# EAGLE design 327final (EAGLE 9.6.2)
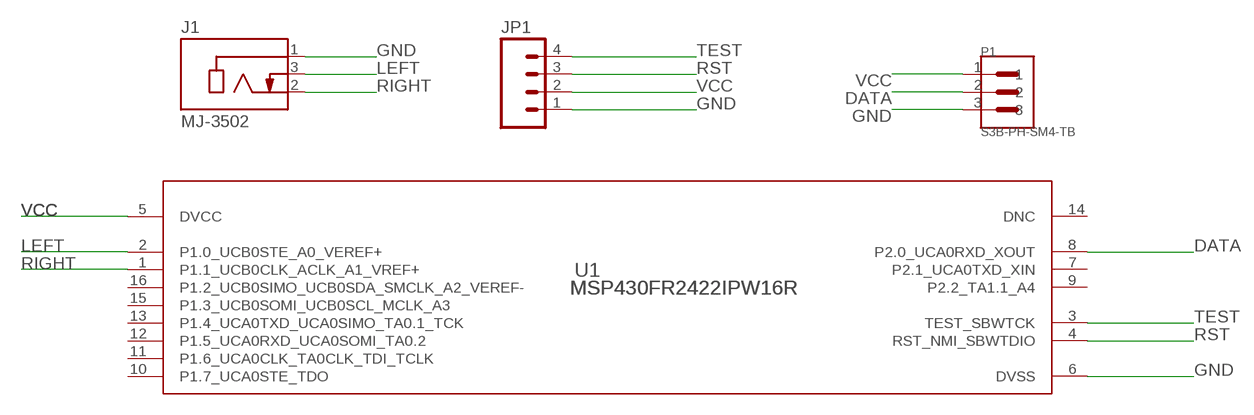
[diagram p0: schematic, sheet 1]

## Parts
J1  MJ-3502  [CUI_MJ-3502]
JP1  HEADER_1X04LOCK  [1X04_LOCK]
P1  S3B-PH-SM4-TB  [JST_S3B-PH-SM4-TB]
U1  MSP430FR2422IPW16R  [PW0016A_N]

## Nets
DATA: P1.2 U1.8(P2.0_UCA0RXD_XOUT)
GND: J1.1 JP1.1 P1.3 U1.6(DVSS)
LEFT: J1.3 U1.2(P1.0_UCB0STE_A0_VEREF+)
RIGHT: J1.2 U1.1(P1.1_UCB0CLK_ACLK_A1_VREF+)
RST: JP1.3 U1.4(RST_NMI_SBWTDIO)
TEST: JP1.4 U1.3(TEST_SBWTCK)
VCC: JP1.2 P1.1 U1.5(DVCC)
Unconnected: U1.7(P2.1_UCA0TXD_XIN) U1.9(P2.2_TA1.1_A4) U1.10(P1.7_UCA0STE_TDO) U1.11(P1.6_UCA0CLK_TA0CLK_TDI_TCLK) U1.12(P1.5_UCA0RXD_UCA0SOMI_TA0.2) U1.13(P1.4_UCA0TXD_UCA0SIMO_TA0.1_TCK) U1.15(P1.3_UCB0SOMI_UCB0SCL_MCLK_A3) U1.16(P1.2_UCB0SIMO_UCB0SDA_SMCLK_A2_VEREF-)

## Power pins joined to a net without a drawn wire
DNC: U1.14(DNC)

## Library data of the parts
J1 = MJ-3502:MJ-3502: 3.5 mm, Mono, Right Angle, Through Hole, Threaded Bushing, Audio Jack Connector; MANUFACTURER: CUI INC; PART_REV: A; STANDARD: MANUFACTURER RECOMMENDATIONS
JP1 = ELEC327:HEADER_1X04: Header 4 Standard 4-pin 0.1" header. Use with straight break away headers (SKU : PRT-00116), right angle break away headers (PRT-00553), swiss pins (PRT-00743), machine pins (PRT-00117), and female headers (PRT-00115). Molex polarized connector foot print use with SKU : PRT-08231 with associated crimp pins and housings.
P1 = S3B-PH-SM4-TB:S3B-PH-SM4-TB: CONN HEADER PH SIDE 3POS 2MM SMD Check availability <https://pricing.snapeda.com/parts/S3B-PH-SM4-TB/JST/view-part?ref=eda>; AVAILABILITY: In Stock; DESCRIPTION: Connector Header Surface Mount, Right Angle 3 position 0.079 (2.00mm); MF: JST; MP: S3B-PH-SM4-TB; PACKAGE: None; PRICE: None
U1 = ELEC327:MSP430FR2422IPW16R; COPYRIGHT: Copyright (C) 2023 Ultra Librarian. All rights reserved.; MANUFACTURER_PART_NUMBER: MSP430FR2422IPW16R; MFR_NAME: Texas Instruments; REFDES: RefDes; TYPE: TYPE

## Board
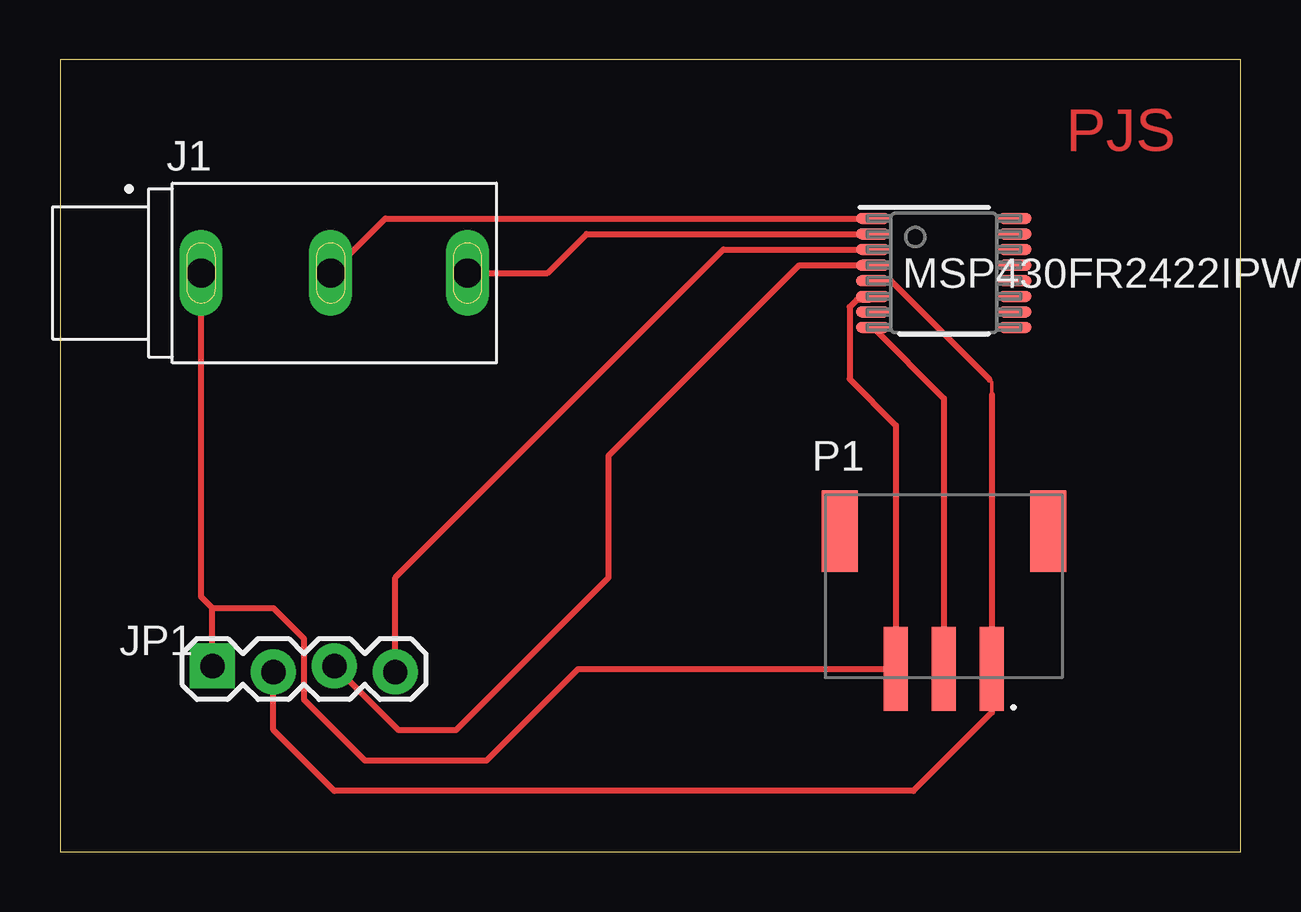
[diagram p1: board, top side]
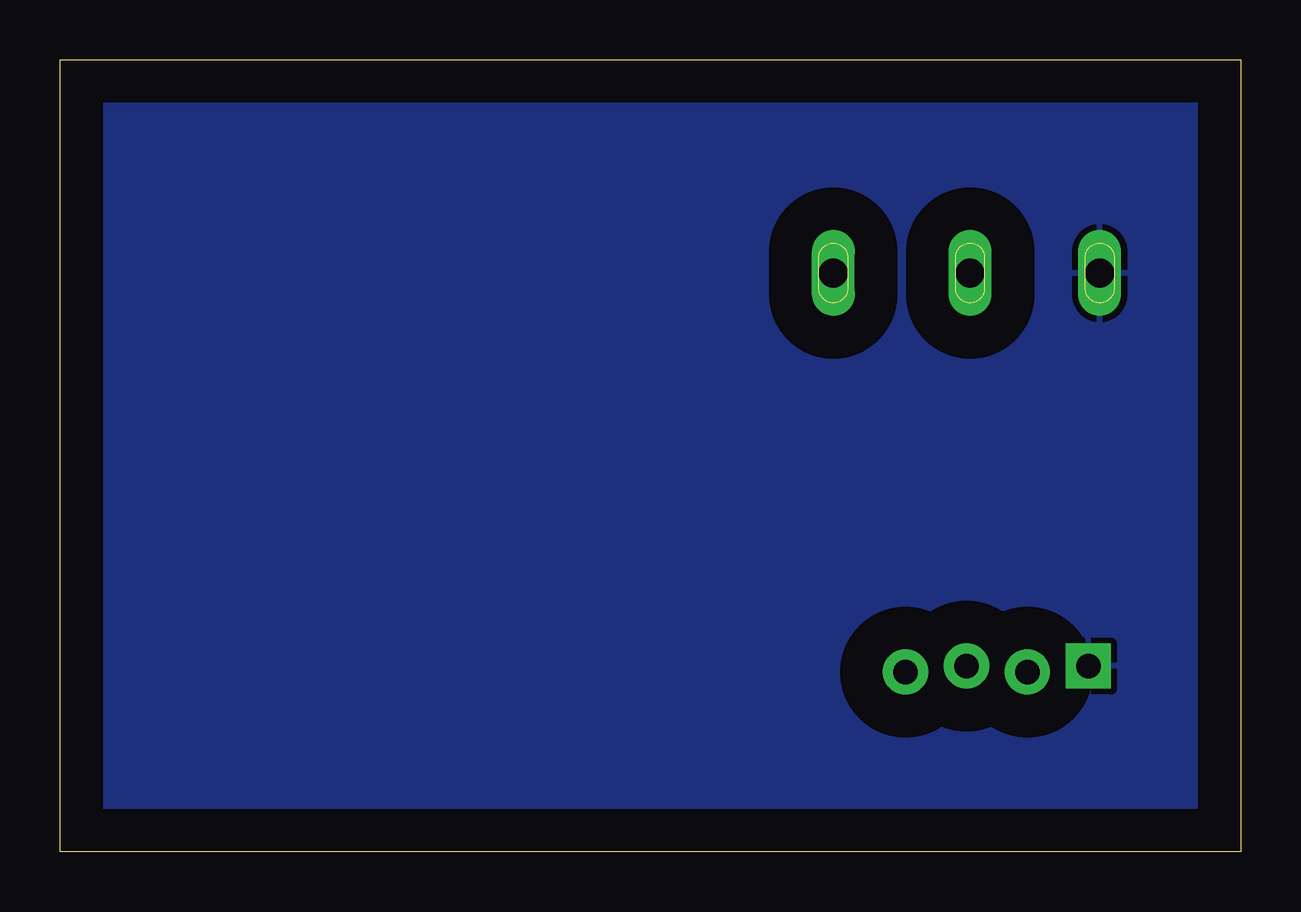
[diagram p2: board, bottom side, seen from below]

Size 49.2 x 33.01 mm. Coordinates in mm from the lower left corner, seen from the top.
Outline: 0,0 49.2,0 49.2,33.01 0,33.01 0,0
Copper layers (1*16): Top 0.035mm / dielectric 1.5mm / Bottom 0.035mm
Design rules "default": minimum track width 6mil, minimum drill 0.35mm, track to track 6mil, track to pad 6mil, pad to pad 6mil, via to via 6mil, smd to smd 6mil, copper to edge 40mil, drill to drill 6mil, minimum pad ring 10mil, minimum via ring 8mil, stop-mask expansion 4mil, vias tented up to drill 0mil, thermal gap 10mil

### Footprints (pad centres in the part's own frame; a part is rotated, then mirrored left to right if it is on the bottom)
CUI_MJ-3502 = drill 1.2 long: 1 -5.55,0; 2 -0.15,0; 3 5.55,0
1X04_LOCK = drill 1.016 pad 1.88 square: 1 0,0.127 | drill 1.016 pad 1.88: 2 2.54,-0.127; 3 5.08,0.127; 4 7.62,-0.127
JST_S3B-PH-SM4-TB = smd 1 x 3.5: 1 2,0; 2 0,0; 3 -2,0 | smd 1.5 x 3.4: P1 4.35,5.75; P2 -4.35,5.75
PW0016A_N = smd 1.4 x 0.45: 1 -2.95,2.275; 2 -2.95,1.625; 3 -2.95,0.975; 4 -2.95,0.325; 5 -2.95,-0.325; 6 -2.95,-0.975; 7 -2.95,-1.625; 8 -2.95,-2.275; 9 2.95,-2.275; 10 2.95,-1.625; 11 2.95,-0.975; 12 2.95,-0.325; 13 2.95,0.325; 14 2.95,0.975; 15 2.95,1.625; 16 2.95,2.275

### Placement (x,y rotation side)
J1  11.43,24.13 0 top
JP1  6.35,7.62 0 top
P1  36.83,7.62 0 top
U1  36.83,24.13 0 top

### Tracks (layer width: path | path; a pad name or v marks a point on that pad's centre or on a via)
DATA
  Top 0.254: U1.8 36.83,18.91 36.83,10.16 36.83,8.89 P1.2
GND
  Top 0.152: 34.83,8.89 P1.3
  Top 0.254: JP1.1 6.35,10.16 | 6.35,10.16 5.88,10.63 J1.1 | 6.35,10.16 8.89,10.16 10.16,8.89 10.16,6.35 12.7,3.81 17.78,3.81 21.59,7.62 P1.3 | U1.6 33.73,23.01 33.2,23.01 32.9,22.71 32.9,19.71 34.83,17.78 34.83,8.89
  pour Bottom (isolate 1.778): 0,0 49.53,0 49.53,33.02 0,33.02
LEFT
  Top 0.254: J1.3 20.32,24.13 21.95,25.75 U1.2
RIGHT
  Top 0.254: J1.2 13.55,26.41 U1.1
RST
  Top 0.254: JP1.3 14.1,5.08 16.51,5.08 22.86,11.43 22.86,16.51 30.8,24.45 U1.4
TEST
  Top 0.254: JP1.4 13.97,11.43 27.64,25.11 U1.3
VCC
  Top 0.152: 38.83,19.05 38.83,19.59 38.73,19.68
  Top 0.254: U1.5 34.62,23.8 38.73,19.68 | 38.83,19.05 P1.1 38.83,5.81 35.56,2.54 11.43,2.54 8.89,5.08 JP1.2

### Text on the board
Top: PJS